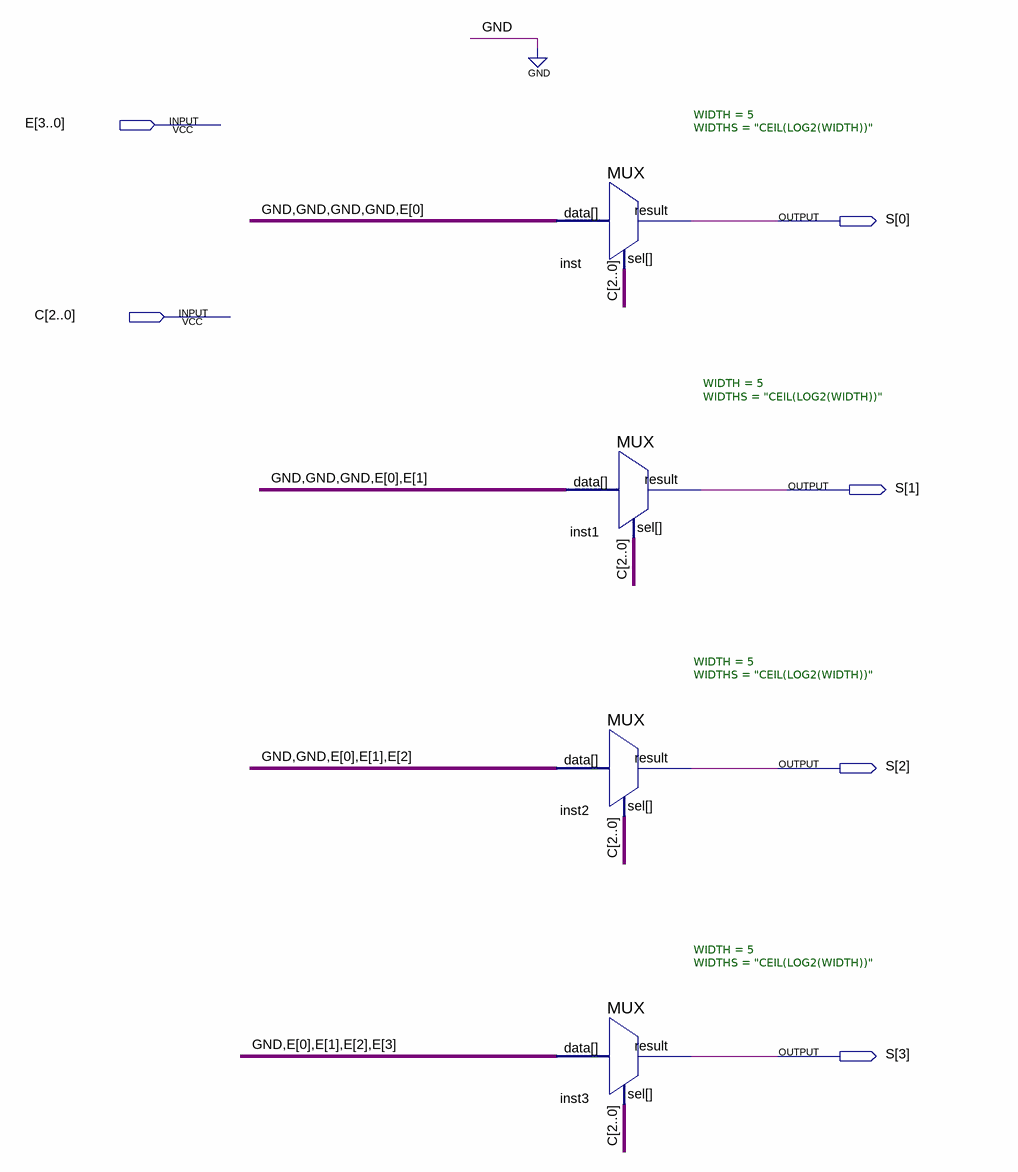
[diagram p0: schematic sheet]
// Quartus schematic shift_l.bdf as structural Verilog: 4 symbols, 6 pins
module shift_l (
  input  [3:0] E,
  input  [2:0] C,
  output [3:0] S
);

  MUX #(.WIDTH(5), .WIDTHS("CEIL(LOG2(WIDTH))")) inst (.data({4'b0000, E[0]}), .sel(C), .result(S[0]));
  MUX #(.WIDTH(5), .WIDTHS("CEIL(LOG2(WIDTH))")) inst1 (.data({3'b000, E[0], E[1]}), .sel(C), .result(S[1]));
  MUX #(.WIDTH(5), .WIDTHS("CEIL(LOG2(WIDTH))")) inst2 (.data({2'b00, E[0], E[1], E[2]}), .sel(C), .result(S[2]));
  MUX #(.WIDTH(5), .WIDTHS("CEIL(LOG2(WIDTH))")) inst3 (.data({1'b0, E[0], E[1], E[2], E[3]}), .sel(C), .result(S[3]));
endmodule
